# EAGLE design PGTN021_octasource_led_drivers (EAGLE 9.6.0)
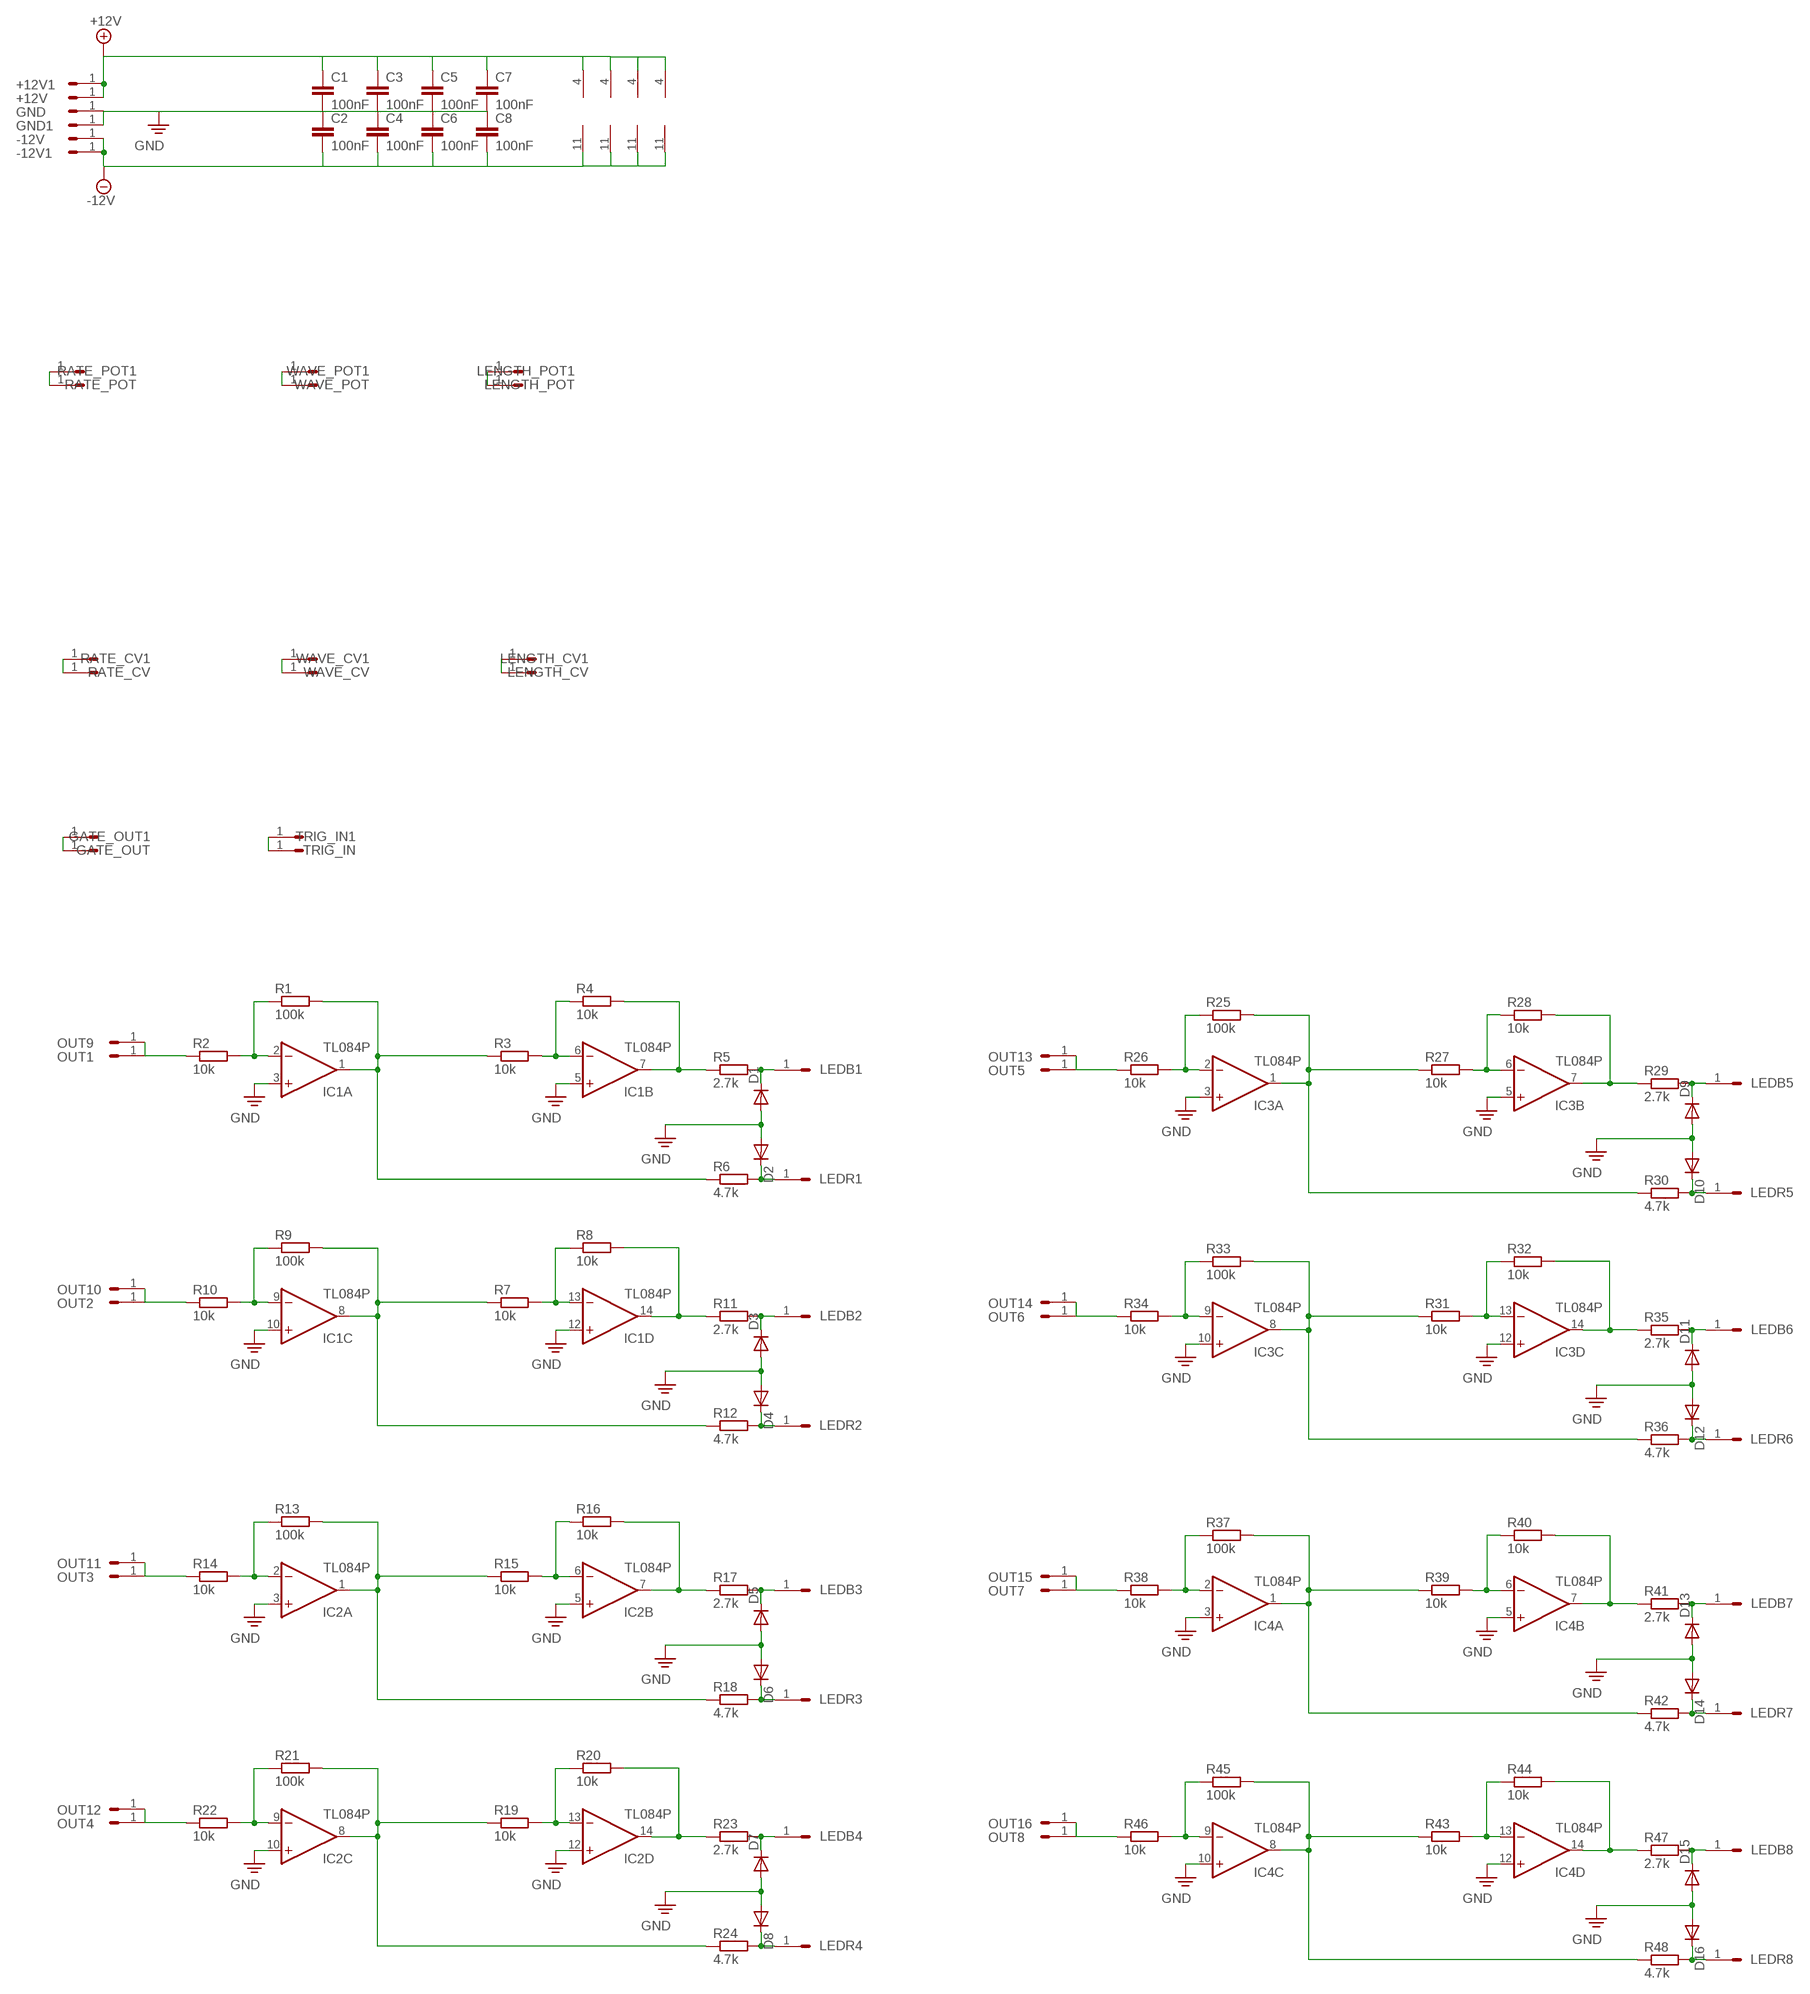
[diagram p0: schematic, sheet 1]

## Parts
+12V  HEADER/MALE/01  [HEADER/MALE/01]
+12V1  HEADER/MALE/01  [HEADER/MALE/01]
-12V  HEADER/MALE/01  [HEADER/MALE/01]
-12V1  HEADER/MALE/01  [HEADER/MALE/01]
C1  100nF  CAPACITORCERAMICDISC/5  [CERAMICDISC/5]
C2  100nF  CAPACITORCERAMICDISC/5  [CERAMICDISC/5]
C3  100nF  CAPACITORCERAMICDISC/5  [CERAMICDISC/5]
C4  100nF  CAPACITORCERAMICDISC/5  [CERAMICDISC/5]
C5  100nF  CAPACITORCERAMICDISC/5  [CERAMICDISC/5]
C6  100nF  CAPACITORCERAMICDISC/5  [CERAMICDISC/5]
C7  100nF  CAPACITORCERAMICDISC/5  [CERAMICDISC/5]
C8  100nF  CAPACITORCERAMICDISC/5  [CERAMICDISC/5]
D1  1N4148DO35-7  [DO35-7]
D2  1N4148DO35-7  [DO35-7]
D3  1N4148DO35-7  [DO35-7]
D4  1N4148DO35-7  [DO35-7]
D5  1N4148DO35-7  [DO35-7]
D6  1N4148DO35-7  [DO35-7]
D7  1N4148DO35-7  [DO35-7]
D8  1N4148DO35-7  [DO35-7]
D9  1N4148DO35-7  [DO35-7]
D10  1N4148DO35-7  [DO35-7]
D11  1N4148DO35-7  [DO35-7]
D12  1N4148DO35-7  [DO35-7]
D13  1N4148DO35-7  [DO35-7]
D14  1N4148DO35-7  [DO35-7]
D15  1N4148DO35-7  [DO35-7]
D16  1N4148DO35-7  [DO35-7]
GATE_OUT  HEADER/MALE/01  [HEADER/MALE/01]
GATE_OUT1  HEADER/MALE/01  [HEADER/MALE/01]
GND  HEADER/MALE/01  [HEADER/MALE/01]
GND1  HEADER/MALE/01  [HEADER/MALE/01]
IC1  TL084P  [DIL14]
IC2  TL084P  [DIL14]
IC3  TL084P  [DIL14]
IC4  TL084P  [DIL14]
LEDB1  HEADER/MALE/01  [HEADER/MALE/01]
LEDB2  HEADER/MALE/01  [HEADER/MALE/01]
LEDB3  HEADER/MALE/01  [HEADER/MALE/01]
LEDB4  HEADER/MALE/01  [HEADER/MALE/01]
LEDB5  HEADER/MALE/01  [HEADER/MALE/01]
LEDB6  HEADER/MALE/01  [HEADER/MALE/01]
LEDB7  HEADER/MALE/01  [HEADER/MALE/01]
LEDB8  HEADER/MALE/01  [HEADER/MALE/01]
LEDR1  HEADER/MALE/01  [HEADER/MALE/01]
LEDR2  HEADER/MALE/01  [HEADER/MALE/01]
LEDR3  HEADER/MALE/01  [HEADER/MALE/01]
LEDR4  HEADER/MALE/01  [HEADER/MALE/01]
LEDR5  HEADER/MALE/01  [HEADER/MALE/01]
LEDR6  HEADER/MALE/01  [HEADER/MALE/01]
LEDR7  HEADER/MALE/01  [HEADER/MALE/01]
LEDR8  HEADER/MALE/01  [HEADER/MALE/01]
LENGTH_CV  HEADER/MALE/01  [HEADER/MALE/01]
LENGTH_CV1  HEADER/MALE/01  [HEADER/MALE/01]
LENGTH_POT  HEADER/MALE/01  [HEADER/MALE/01]
LENGTH_POT1  HEADER/MALE/01  [HEADER/MALE/01]
OUT1  HEADER/MALE/01  [HEADER/MALE/01]
OUT2  HEADER/MALE/01  [HEADER/MALE/01]
OUT3  HEADER/MALE/01  [HEADER/MALE/01]
OUT4  HEADER/MALE/01  [HEADER/MALE/01]
OUT5  HEADER/MALE/01  [HEADER/MALE/01]
OUT6  HEADER/MALE/01  [HEADER/MALE/01]
OUT7  HEADER/MALE/01  [HEADER/MALE/01]
OUT8  HEADER/MALE/01  [HEADER/MALE/01]
OUT9  HEADER/MALE/01  [HEADER/MALE/01]
OUT10  HEADER/MALE/01  [HEADER/MALE/01]
OUT11  HEADER/MALE/01  [HEADER/MALE/01]
OUT12  HEADER/MALE/01  [HEADER/MALE/01]
OUT13  HEADER/MALE/01  [HEADER/MALE/01]
OUT14  HEADER/MALE/01  [HEADER/MALE/01]
OUT15  HEADER/MALE/01  [HEADER/MALE/01]
OUT16  HEADER/MALE/01  [HEADER/MALE/01]
R1  100k  RESISTORRESISTOR/UPRIGHT/7.5  [RESISTOR/7.5]
R2  10k  RESISTORRESISTOR/UPRIGHT/7.5  [RESISTOR/7.5]
R3  10k  RESISTORRESISTOR/UPRIGHT/7.5  [RESISTOR/7.5]
R4  10k  RESISTORRESISTOR/UPRIGHT/7.5  [RESISTOR/7.5]
R5  2.7k  RESISTORRESISTOR/UPRIGHT/7.5  [RESISTOR/7.5]
R6  4.7k  RESISTORRESISTOR/UPRIGHT/7.5  [RESISTOR/7.5]
R7  10k  RESISTORRESISTOR/UPRIGHT/7.5  [RESISTOR/7.5]
R8  10k  RESISTORRESISTOR/UPRIGHT/7.5  [RESISTOR/7.5]
R9  100k  RESISTORRESISTOR/UPRIGHT/7.5  [RESISTOR/7.5]
R10  10k  RESISTORRESISTOR/UPRIGHT/7.5  [RESISTOR/7.5]
R11  2.7k  RESISTORRESISTOR/UPRIGHT/7.5  [RESISTOR/7.5]
R12  4.7k  RESISTORRESISTOR/UPRIGHT/7.5  [RESISTOR/7.5]
R13  100k  RESISTORRESISTOR/UPRIGHT/7.5  [RESISTOR/7.5]
R14  10k  RESISTORRESISTOR/UPRIGHT/7.5  [RESISTOR/7.5]
R15  10k  RESISTORRESISTOR/UPRIGHT/7.5  [RESISTOR/7.5]
R16  10k  RESISTORRESISTOR/UPRIGHT/7.5  [RESISTOR/7.5]
R17  2.7k  RESISTORRESISTOR/UPRIGHT/7.5  [RESISTOR/7.5]
R18  4.7k  RESISTORRESISTOR/UPRIGHT/7.5  [RESISTOR/7.5]
R19  10k  RESISTORRESISTOR/UPRIGHT/7.5  [RESISTOR/7.5]
R20  10k  RESISTORRESISTOR/UPRIGHT/7.5  [RESISTOR/7.5]
R21  100k  RESISTORRESISTOR/UPRIGHT/7.5  [RESISTOR/7.5]
R22  10k  RESISTORRESISTOR/UPRIGHT/7.5  [RESISTOR/7.5]
R23  2.7k  RESISTORRESISTOR/UPRIGHT/7.5  [RESISTOR/7.5]
R24  4.7k  RESISTORRESISTOR/UPRIGHT/7.5  [RESISTOR/7.5]
R25  100k  RESISTORRESISTOR/UPRIGHT/7.5  [RESISTOR/7.5]
R26  10k  RESISTORRESISTOR/UPRIGHT/7.5  [RESISTOR/7.5]
R27  10k  RESISTORRESISTOR/UPRIGHT/7.5  [RESISTOR/7.5]
R28  10k  RESISTORRESISTOR/UPRIGHT/7.5  [RESISTOR/7.5]
R29  2.7k  RESISTORRESISTOR/UPRIGHT/7.5  [RESISTOR/7.5]
R30  4.7k  RESISTORRESISTOR/UPRIGHT/7.5  [RESISTOR/7.5]
R31  10k  RESISTORRESISTOR/UPRIGHT/7.5  [RESISTOR/7.5]
R32  10k  RESISTORRESISTOR/UPRIGHT/7.5  [RESISTOR/7.5]
R33  100k  RESISTORRESISTOR/UPRIGHT/7.5  [RESISTOR/7.5]
R34  10k  RESISTORRESISTOR/UPRIGHT/7.5  [RESISTOR/7.5]
R35  2.7k  RESISTORRESISTOR/UPRIGHT/7.5  [RESISTOR/7.5]
R36  4.7k  RESISTORRESISTOR/UPRIGHT/7.5  [RESISTOR/7.5]
R37  100k  RESISTORRESISTOR/UPRIGHT/7.5  [RESISTOR/7.5]
R38  10k  RESISTORRESISTOR/UPRIGHT/7.5  [RESISTOR/7.5]
R39  10k  RESISTORRESISTOR/UPRIGHT/7.5  [RESISTOR/7.5]
R40  10k  RESISTORRESISTOR/UPRIGHT/7.5  [RESISTOR/7.5]
R41  2.7k  RESISTORRESISTOR/UPRIGHT/7.5  [RESISTOR/7.5]
R42  4.7k  RESISTORRESISTOR/UPRIGHT/7.5  [RESISTOR/7.5]
R43  10k  RESISTORRESISTOR/UPRIGHT/7.5  [RESISTOR/7.5]
R44  10k  RESISTORRESISTOR/UPRIGHT/7.5  [RESISTOR/7.5]
R45  100k  RESISTORRESISTOR/UPRIGHT/7.5  [RESISTOR/7.5]
R46  10k  RESISTORRESISTOR/UPRIGHT/7.5  [RESISTOR/7.5]
R47  2.7k  RESISTORRESISTOR/UPRIGHT/7.5  [RESISTOR/7.5]
R48  4.7k  RESISTORRESISTOR/UPRIGHT/7.5  [RESISTOR/7.5]
RATE_CV  HEADER/MALE/01  [HEADER/MALE/01]
RATE_CV1  HEADER/MALE/01  [HEADER/MALE/01]
RATE_POT  HEADER/MALE/01  [HEADER/MALE/01]
RATE_POT1  HEADER/MALE/01  [HEADER/MALE/01]
TRIG_IN  HEADER/MALE/01  [HEADER/MALE/01]
TRIG_IN1  HEADER/MALE/01  [HEADER/MALE/01]
WAVE_CV  HEADER/MALE/01  [HEADER/MALE/01]
WAVE_CV1  HEADER/MALE/01  [HEADER/MALE/01]
WAVE_POT  HEADER/MALE/01  [HEADER/MALE/01]
WAVE_POT1  HEADER/MALE/01  [HEADER/MALE/01]

## Nets
+12V: +12V1.1 +12V.1 C1.1 C3.1 C5.1 C7.1 IC1.4(P:V+) IC2.4(P:V+) IC3.4(P:V+) IC4.4(P:V+)
-12V: -12V1.1 -12V.1 C2.2 C4.2 C6.2 C8.2 IC1.11(P:V-) IC2.11(P:V-) IC3.11(P:V-) IC4.11(P:V-)
N$1: IC1.6(B:-IN) R3.2 R4.1
N$2: IC1.2(A:-IN) R1.1 R2.2
N$3: IC1.1(A:OUT) R1.2 R3.1 R6.1
N$4: OUT1.1 OUT9.1 R2.1
N$5: IC1.7(B:OUT) R4.2 R5.1
N$6: D1.C LEDB1.1 R5.2
N$7: D2.C LEDR1.1 R6.2
N$8: IC1.13(D:-IN) R7.2 R8.1
N$9: IC1.9(C:-IN) R9.1 R10.2
N$10: OUT2.1 OUT10.1 R10.1
N$11: IC1.14(D:OUT) R8.2 R11.1
N$12: IC1.8(C:OUT) R7.1 R9.2 R12.1
N$13: IC2.2(A:-IN) R13.1 R14.2
N$14: D3.C LEDB2.1 R11.2
N$15: D4.C LEDR2.1 R12.2
N$16: IC2.1(A:OUT) R13.2 R15.1 R18.1
N$17: IC2.6(B:-IN) R15.2 R16.1
N$18: OUT3.1 OUT11.1 R14.1
N$19: IC2.7(B:OUT) R16.2 R17.1
N$20: D5.C LEDB3.1 R17.2
N$21: D6.C LEDR3.1 R18.2
N$22: IC2.13(D:-IN) R19.2 R20.1
N$23: IC2.9(C:-IN) R21.1 R22.2
N$24: IC2.14(D:OUT) R20.2 R23.1
N$25: IC2.8(C:OUT) R19.1 R21.2 R24.1
N$26: D7.C LEDB4.1 R23.2
N$27: D8.C LEDR4.1 R24.2
N$28: OUT4.1 OUT12.1 R22.1
N$29: IC3.2(A:-IN) R25.1 R26.2
N$30: IC3.1(A:OUT) R25.2 R27.1 R30.1
N$31: IC3.6(B:-IN) R27.2 R28.1
N$32: OUT5.1 OUT13.1 R26.1
N$33: IC3.7(B:OUT) R28.2 R29.1
N$34: D9.C LEDB5.1 R29.2
N$35: D10.C LEDR5.1 R30.2
N$36: IC3.13(D:-IN) R31.2 R32.1
N$37: IC3.9(C:-IN) R33.1 R34.2
N$38: IC3.14(D:OUT) R32.2 R35.1
N$39: IC3.8(C:OUT) R31.1 R33.2 R36.1
N$40: D11.C LEDB6.1 R35.2
N$41: D12.C LEDR6.1 R36.2
N$42: OUT6.1 OUT14.1 R34.1
N$43: RATE_POT1.1 RATE_POT.1
N$44: IC4.2(A:-IN) R37.1 R38.2
N$45: IC4.1(A:OUT) R37.2 R39.1 R42.1
N$46: IC4.6(B:-IN) R39.2 R40.1
N$47: OUT7.1 OUT15.1 R38.1
N$48: IC4.7(B:OUT) R40.2 R41.1
N$49: D13.C LEDB7.1 R41.2
N$50: D14.C LEDR7.1 R42.2
N$51: IC4.13(D:-IN) R43.2 R44.1
N$52: IC4.9(C:-IN) R45.1 R46.2
N$53: IC4.14(D:OUT) R44.2 R47.1
N$54: IC4.8(C:OUT) R43.1 R45.2 R48.1
N$55: D15.C LEDB8.1 R47.2
N$56: D16.C LEDR8.1 R48.2
N$57: OUT8.1 OUT16.1 R46.1
N$58: RATE_CV1.1 RATE_CV.1
N$59: GATE_OUT1.1 GATE_OUT.1
N$60: TRIG_IN1.1 TRIG_IN.1
N$61: WAVE_CV1.1 WAVE_CV.1
N$62: LENGTH_CV1.1 LENGTH_CV.1
N$63: LENGTH_POT1.1 LENGTH_POT.1
N$64: WAVE_POT1.1 WAVE_POT.1
PE: C1.2 C2.1 C3.2 C4.1 C5.2 C6.1 C7.2 C8.1 D1.A D2.A D3.A D4.A D5.A D6.A D7.A D8.A D9.A D10.A D11.A D12.A D13.A D14.A D15.A D16.A GND1.1 GND.1 IC1.3(A:+IN) IC1.5(B:+IN) IC1.10(C:+IN) IC1.12(D:+IN) IC2.3(A:+IN) IC2.5(B:+IN) IC2.10(C:+IN) IC2.12(D:+IN) IC3.3(A:+IN) IC3.5(B:+IN) IC3.10(C:+IN) IC3.12(D:+IN) IC4.3(A:+IN) IC4.5(B:+IN) IC4.10(C:+IN) IC4.12(D:+IN) ; supply symbol labelled GND

## Library data of the parts
+12V +12V1 -12V -12V1 GATE_OUT GATE_OUT1 GND GND1 LEDB1-LEDB8 LEDR1-LEDR8 LENGTH_CV LENGTH_CV1 LENGTH_POT LENGTH_POT1 OUT1-OUT16 RATE_CV RATE_CV1 RATE_POT RATE_POT1 TRIG_IN TRIG_IN1 WAVE_CV WAVE_CV1 WAVE_POT WAVE_POT1 = connectors:HEADER/MALE/01
C1-C8 = capacitors:CAPACITOR: CAPACITOR, European symbol
D1-D16 = transistors:1N4148: DIODE high speed (Philips)
IC1-IC4 = ic_analogue:TL084: OP AMP
R1-R48 = resistors:RESISTOR: RESISTOR, European symbol

## Board
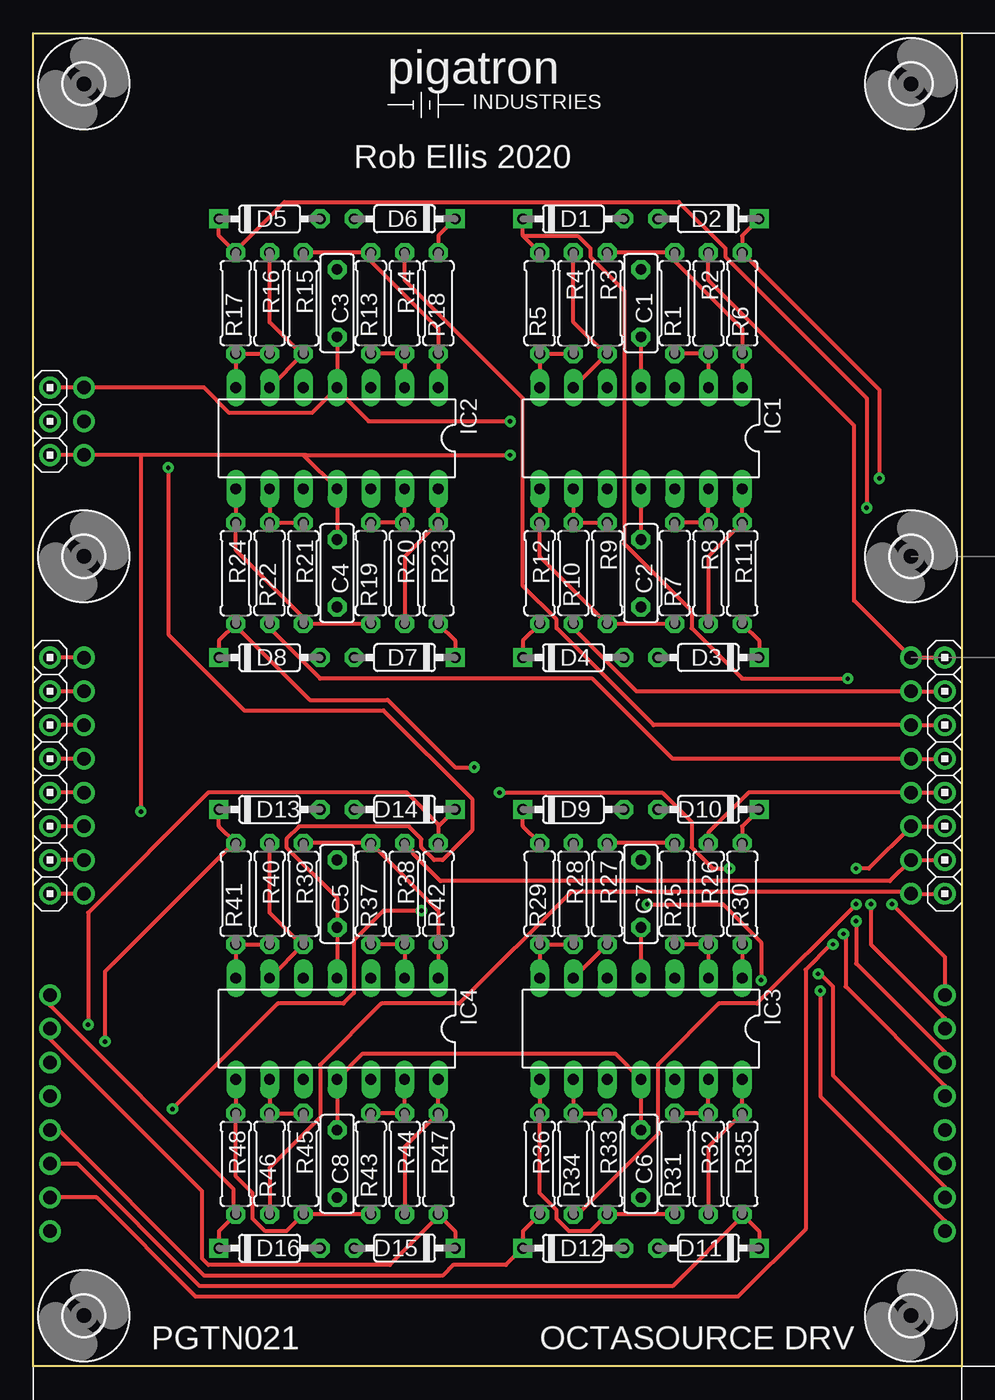
[diagram p1: board, top side]
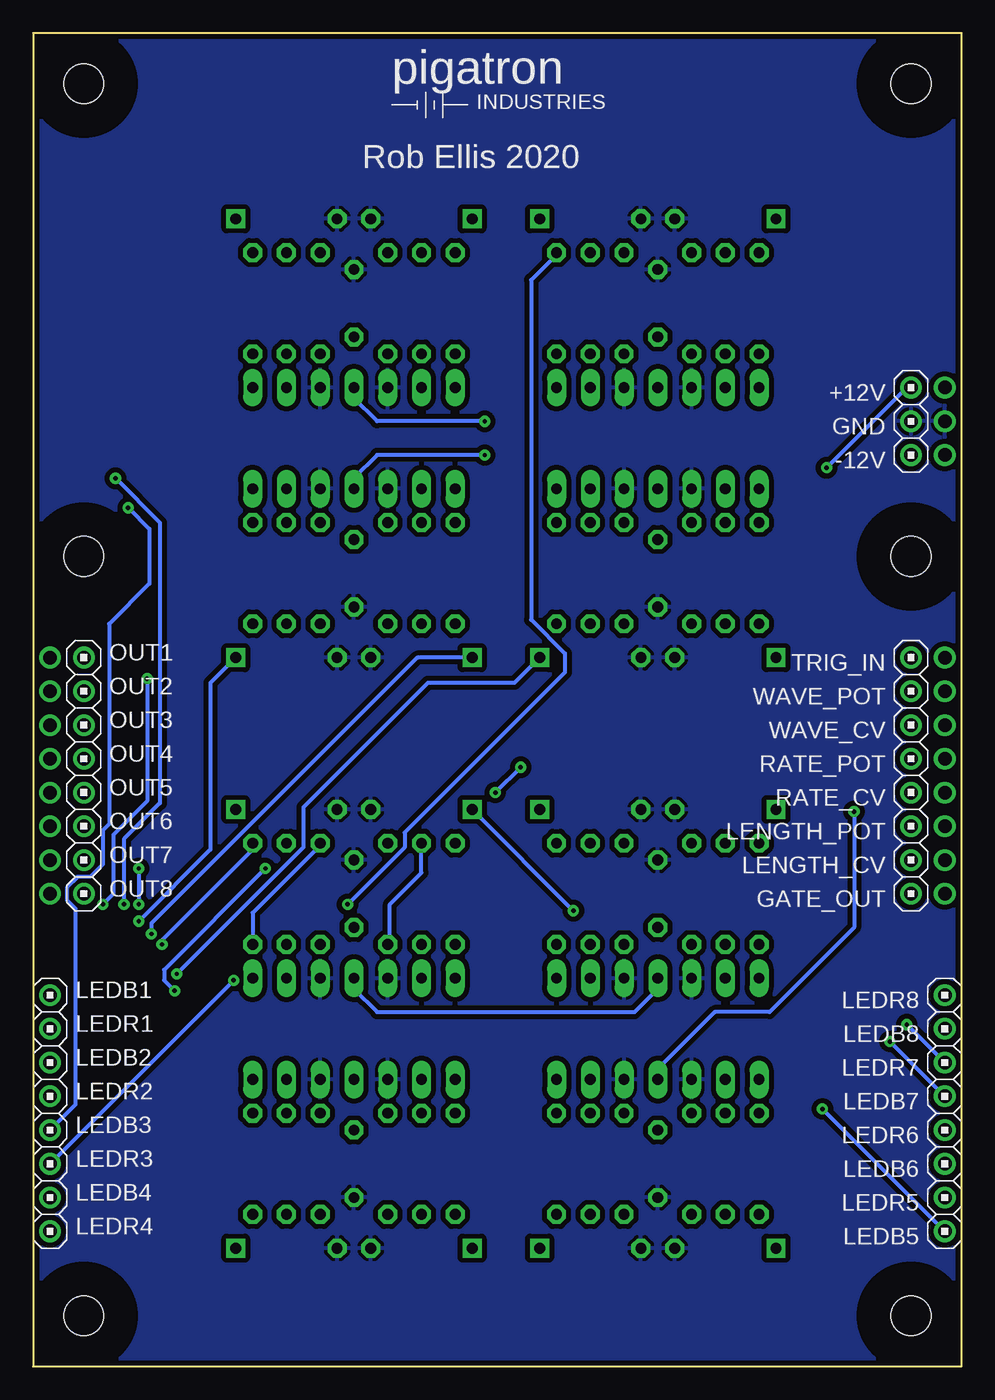
[diagram p2: board, bottom side, seen from below]

Size 69.85 x 100.33 mm. Coordinates in mm from the lower left corner, seen from the top.
Outline: 0,0 0,100.33 69.85,100.33 69.85,0 0,0
Copper layers (1*16): Top 0.0356mm / dielectric 1.5011mm / Bottom 0.0356mm
Design rules "pigatron": minimum track width 12mil, minimum drill 13mil, track to track 15mil, track to pad 10mil, pad to pad 10mil, via to via 10mil, smd to smd 6mil, copper to edge 15mil, drill to drill 10mil, minimum pad ring 12mil, minimum via ring 10mil, stop-mask expansion 4mil, vias tented up to drill 0mil, thermal gap 10mil

### Footprints (pad centres in the part's own frame; a part is rotated, then mirrored left to right if it is on the bottom)
HEADER/MALE/01 = drill 1.016: 1 0,0
CERAMICDISC/5 = drill 0.813 octagon: 1 -2.54,0; 2 2.54,0
DO35-7 = drill 0.813 octagon: A 3.81,0 | drill 0.813 square: C -3.81,0
DIL14 = drill 0.813 long: 1 -7.62,-3.81; 2 -5.08,-3.81; 3 -2.54,-3.81; 4 0,-3.81; 5 2.54,-3.81; 6 5.08,-3.81; 7 7.62,-3.81; 8 7.62,3.81; 9 5.08,3.81; 10 2.54,3.81; 11 0,3.81; 12 -2.54,3.81; 13 -5.08,3.81; 14 -7.62,3.81
RESISTOR/7.5 = drill 0.813 octagon: 1 -3.81,0; 2 3.81,0
STANDOFF/3.0 = hole 3: 0,0

### Placement (x,y rotation side)
+12V  3.81,73.66 180 bottom
+12V1  1.27,73.66 0 top
-12V  3.81,68.58 180 bottom
-12V1  1.27,68.58 0 top
C1  45.72,80.01 90 top
C2  45.72,59.69 90 top
C3  22.86,80.01 90 top
C4  22.86,59.69 90 top
C5  22.86,35.56 90 top
C6  45.72,15.24 90 top
C7  45.72,35.56 90 top
C8  22.86,15.24 90 top
D1  40.64,86.36 0 top
D2  50.8,86.36 180 top
D3  50.8,53.34 180 top
D4  40.64,53.34 0 top
D5  17.78,86.36 0 top
D6  27.94,86.36 180 top
D7  27.94,53.34 180 top
D8  17.78,53.34 0 top
D9  40.64,41.91 0 top
D10  50.8,41.91 180 top
D11  50.8,8.89 180 top
D12  40.64,8.89 0 top
D13  17.78,41.91 0 top
D14  27.94,41.91 180 top
D15  27.94,8.89 180 top
D16  17.78,8.89 0 top
GATE_OUT  3.81,35.56 180 bottom
GATE_OUT1  1.27,35.56 0 top
GND  3.81,71.12 180 bottom
GND1  1.27,71.12 0 top
IC1  45.72,69.85 180 top
IC2  22.86,69.85 180 top
IC3  45.72,25.4 180 top
IC4  22.86,25.4 180 top
LEDB1  68.58,27.94 0 bottom
LEDB2  68.58,22.86 0 bottom
LEDB3  68.58,17.78 0 bottom
LEDB4  68.58,12.7 0 bottom
LEDB5  1.27,10.16 180 bottom
LEDB6  1.27,15.24 180 bottom
LEDB7  1.27,20.32 180 bottom
LEDB8  1.27,25.4 180 bottom
LEDR1  68.58,25.4 0 bottom
LEDR2  68.58,20.32 0 bottom
LEDR3  68.58,15.24 0 bottom
LEDR4  68.58,10.16 0 bottom
LEDR5  1.27,12.7 180 bottom
LEDR6  1.27,17.78 180 bottom
LEDR7  1.27,22.86 180 bottom
LEDR8  1.27,27.94 180 bottom
LENGTH_CV  3.81,38.1 180 bottom
LENGTH_CV1  1.27,38.1 0 top
LENGTH_POT  3.81,40.64 180 bottom
LENGTH_POT1  1.27,40.64 0 top
OUT1  66.04,53.34 0 bottom
OUT2  66.04,50.8 0 bottom
OUT3  66.04,48.26 0 bottom
OUT4  66.04,45.72 0 bottom
OUT5  66.04,43.18 0 bottom
OUT6  66.04,40.64 0 bottom
OUT7  66.04,38.1 0 bottom
OUT8  66.04,35.56 0 bottom
OUT9  68.58,53.34 0 top
OUT10  68.58,50.8 0 top
OUT11  68.58,48.26 0 top
OUT12  68.58,45.72 0 top
OUT13  68.58,43.18 0 top
OUT14  68.58,40.64 0 top
OUT15  68.58,38.1 0 top
OUT16  68.58,35.56 0 top
R1  48.26,80.01 90 top
R2  50.8,80.01 270 top
R3  43.18,80.01 270 top
R4  40.64,80.01 270 top
R5  38.1,80.01 90 top
R6  53.34,80.01 90 top
R7  48.26,59.69 90 top
R8  50.8,59.69 270 top
R9  43.18,59.69 270 top
R10  40.64,59.69 90 top
R11  53.34,59.69 270 top
R12  38.1,59.69 270 top
R13  25.4,80.01 90 top
R14  27.94,80.01 270 top
R15  20.32,80.01 270 top
R16  17.78,80.01 270 top
R17  15.24,80.01 90 top
R18  30.48,80.01 90 top
R19  25.4,59.69 90 top
R20  27.94,59.69 270 top
R21  20.32,59.69 270 top
R22  17.78,59.69 90 top
R23  30.48,59.69 270 top
R24  15.24,59.69 270 top
R25  48.26,35.56 90 top
R26  50.8,35.56 270 top
R27  43.18,35.56 270 top
R28  40.64,35.56 270 top
R29  38.1,35.56 90 top
R30  53.34,35.56 90 top
R31  48.26,15.24 90 top
R32  50.8,15.24 270 top
R33  43.18,15.24 270 top
R34  40.64,15.24 90 top
R35  53.34,15.24 270 top
R36  38.1,15.24 270 top
R37  25.4,35.56 90 top
R38  27.94,35.56 270 top
R39  20.32,35.56 270 top
R40  17.78,35.56 270 top
R41  15.24,35.56 90 top
R42  30.48,35.56 90 top
R43  25.4,15.24 90 top
R44  27.94,15.24 270 top
R45  20.32,15.24 270 top
R46  17.78,15.24 90 top
R47  30.48,15.24 270 top
R48  15.24,15.24 270 top
RATE_CV  3.81,43.18 180 bottom
RATE_CV1  1.27,43.18 0 top
RATE_POT  3.81,45.72 180 bottom
RATE_POT1  1.27,45.72 0 top
TRIG_IN  3.81,53.34 180 bottom
TRIG_IN1  1.27,53.34 0 top
U$1  [PIGATRON-LOGO]  35.56,96.52 0 top
U$2  [PIGATRON-LOGO]  33.97,96.52 0 bottom
U$4  [STANDOFF/3.0]  66.04,60.96 0 top
U$5  [STANDOFF/3.0]  3.81,60.96 0 top
U$9  [STANDOFF/3.0]  3.81,3.81 0 top
U$10  [STANDOFF/3.0]  66.04,3.81 0 top
U$11  [STANDOFF/3.0]  3.81,96.52 0 top
U$12  [STANDOFF/3.0]  66.04,96.52 0 top
WAVE_CV  3.81,48.26 180 bottom
WAVE_CV1  1.27,48.26 0 top
WAVE_POT  3.81,50.8 180 bottom
WAVE_POT1  1.27,50.8 0 top

### Tracks (layer width: path | path; a pad name or v marks a point on that pad's centre or on a via)
+12V  (via drill 0.33)
  Top 0.305: IC4.4 C5.1 22.86,35.24 19.05,39.05 19.05,39.69 20,40.64 28.26,40.64 29.21,39.69 29.21,39.05 30.16,38.1 30.8,38.1 33.02,40.32 33.02,42.7 26.35,49.37 15.88,49.37 10.16,55.09 v10.16,67.63 | C7.1 IC3.4 | C1.1 IC1.4 | +12V1.1 +12V.1 12.86,73.66 14.76,71.75 20.95,71.75 IC2.4 | C3.1 IC2.4 | v35.88,71.12 25.24,71.12 22.86,73.5 IC2.4
  Bottom 0.305: IC4.4 22.86,28.42 24.61,26.67 43.97,26.67 45.72,28.42 IC3.4 | IC1.4 45.72,72.87 43.97,71.12 v35.88,71.12 | v10.16,67.63 4.13,73.66 +12V.1
-12V  (via drill 0.33)
  Top 0.305: C8.2 IC4.11 24.77,23.5 43.81,23.5 IC3.11 C6.2 | IC1.11 C2.2 | -12V1.1 -12V.1 8.1,68.58 | C4.2 IC2.11 20.4,68.5 | 8.1,68.58 20.32,68.58 20.4,68.5 | v35.88,68.58 20.48,68.58 20.4,68.5 | 8.1,68.58 v8.1,41.75
  Bottom 0.305: IC1.11 45.72,66.83 43.97,68.58 v35.88,68.58 | IC4.11 22.86,22.38 18.57,26.67 14.45,26.67 8.1,33.02 v8.1,41.75
N$1
  Top 0.305: IC1.6 R3.2 43.02,76.2 40.64,78.58 R4.1
N$2
  Top 0.305: IC1.2 R2.2 R1.1
N$3
  Top 0.305: IC1.1 R6.1 53.34,78.11 47.62,83.82 | 47.62,83.82 R3.1 | 47.62,83.82 R1.2
N$4
  Top 0.305: R2.1 50.8,81.76 61.75,70.8 61.75,57.63 OUT1.1 OUT9.1
N$5
  Top 0.305: IC1.7 R5.1 R4.2
N$6  (via drill 0.33)
  Top 0.305: D1.C 36.83,85.09 36.91,85.01 | R5.2 36.91,85.01 | LEDB1.1 68.58,30.8 v64.61,34.77 | v61.28,51.75 53.34,51.75 49.53,55.56 49.53,56.83 44.45,61.91 44.45,80.96 41.91,83.5 41.91,84.14 40.96,85.09 36.99,85.09 36.91,85.01
  Bottom 0.305: v64.61,34.77 63.82,35.56 63.82,40.01 61.28,42.55 v61.28,51.75
N$7  (via drill 0.33)
  Top 0.305: D2.C 53.34,85.09 R6.2 63.66,73.5 v63.66,66.83 | LEDR1.1 68.58,26.19 63.02,31.75 v63.02,34.77
  Bottom 0.305: v63.02,34.77 63.02,39.69 60.33,42.39 60.33,63.5 v63.66,66.83
N$8
  Top 0.305: R7.2 R8.1 IC1.13
N$9
  Top 0.305: IC1.9 R10.2 R9.1
N$10
  Top 0.305: R10.1 40.64,55.56 45.4,50.8 OUT2.1 OUT10.1
N$11
  Top 0.305: R8.2 50.8,60.96 R11.1 IC1.14
N$12
  Top 0.305: IC1.8 R12.1 38.1,60.96 R9.2 R7.1
N$13
  Top 0.305: IC2.2 R14.2 R13.1
N$14  (via drill 0.33)
  Top 0.305: D3.C 54.61,54.61 R11.2 | LEDB2.1 68.58,23.65 61.91,30.32 v61.91,33.5
  Bottom 0.305: v61.91,33.5 56.52,38.89 56.52,51.44 D3.C
N$15  (via drill 0.33)
  Top 0.305: D4.C 36.83,54.61 R12.2 | LEDR2.1 68.58,21.11 61.12,28.57 61.12,32.38 v60.96,32.54
  Bottom 0.305: v60.96,32.54 60.96,33.34 40.96,53.34 D4.C
N$16
  Top 0.305: IC2.1 R18.1 30.48,78.11 24.77,83.82 | 24.77,83.82 R15.1 | 24.77,83.82 R13.2
N$17
  Top 0.305: IC2.6 R15.2 20.16,76.2 17.78,78.58 R16.1
N$18
  Top 0.305: R14.1 27.94,81.76 36.83,72.87 36.83,58.74 39.37,56.2 39.37,55.56 46.67,48.26 OUT3.1 OUT11.1
N$19
  Top 0.305: IC2.7 R17.1 R16.2
N$20  (via drill 0.33)
  Top 0.305: D5.C 13.97,85.09 R17.2 15.24,83.98 18.89,87.63 48.58,87.63 52.07,84.14 52.07,83.5 62.71,72.87 v62.71,64.61
  Bottom 0.305: LEDB3.1 66.67,19.68 66.67,34.45 67.31,35.08 67.31,36.04 66.52,36.83 65.56,36.83 64.61,37.78 64.61,40.32 64.14,40.8 64.14,55.88 61.12,58.9 61.12,63.02 v62.71,64.61
N$21  (via drill 0.33)
  Top 0.305: R18.2 30.48,85.09 D6.C | v54.77,29.05 54.77,31.91 51.91,34.77 v46.2,34.77
  Bottom 0.305: v54.77,29.05 LEDR3.1 | v46.2,34.77 41.91,39.05 41.91,40.16 29.84,52.23 29.84,53.66 32.38,56.2 32.38,81.76 30.48,83.66 R18.2
N$22
  Top 0.305: R19.2 R20.1 IC2.13
N$23
  Top 0.305: IC2.9 R22.2 R21.1
N$24
  Top 0.305: R20.2 27.94,60.96 R23.1 IC2.14
N$25
  Top 0.305: IC2.8 R24.1 15.24,61.44 20.8,55.88 | R19.1 20.8,55.88 | 20.8,55.88 R21.2
N$26  (via drill 0.33)
  Top 0.305: D7.C 31.75,54.61 R23.2 | LEDB4.1 68.58,13.49 60.17,21.91 60.17,28.57 59.21,29.53 v59.05,29.53
  Bottom 0.305: v59.05,29.53 49.53,39.05 49.53,42.07 40.16,51.44 33.66,51.44 D7.C
N$27  (via drill 0.33)
  Top 0.305: D8.C 13.97,54.61 R24.2 15.24,55.72 20.8,50.16 26.67,50.16 31.75,45.09 v33.18,45.09 | LEDR4.1 68.58,10.95 59.21,20.32 v59.21,28.26 | v52.39,37.47 51.12,37.47 49.53,39.05 49.53,40.96 47.31,43.18 v35.08,43.18
  Bottom 0.305: v59.21,28.26 60.01,29.05 60.01,29.84 v52.39,37.47 | v33.18,45.09 v35.08,43.18
N$28
  Top 0.305: R22.1 17.78,55.56 21.59,51.75 42.07,51.75 48.1,45.72 OUT4.1 OUT12.1
N$29
  Top 0.305: IC3.2 R26.2 R25.1
N$30
  Top 0.305: R30.1 IC3.1 | R25.2 R27.1
  Bottom 0.305: R30.1 53.34,34.13 48.26,39.21 R25.2
N$31
  Top 0.305: R27.2 IC3.6
  Bottom 0.305: R28.1 40.64,37.15 43.02,34.77 43.02,31.91 R27.2
N$32
  Top 0.305: R26.1 50.8,40.16 53.82,43.18 OUT5.1 OUT13.1
N$33
  Top 0.305: IC3.7 R29.1 R28.2
N$34  (via drill 0.33)
  Top 0.305: D9.C 36.83,40.64 R29.2 | v10.48,19.37 18.41,27.3 23.34,27.3 24.13,28.1 24.13,32.07 26.35,34.29 v29.21,34.29
  Bottom 0.305: v10.48,19.37 LEDB5.1 | D9.C v29.21,34.29
N$35  (via drill 0.33)
  Top 0.305: R30.2 53.34,40.64 D10.C | LEDR5.1 4.76,12.7 12.22,5.24 53.02,5.24 58.1,10.32 58.1,29.84 60.01,31.75 v60.17,31.75
  Bottom 0.305: v60.17,31.75 60.17,32.07 53.34,38.89 R30.2
N$36
  Top 0.305: R31.2 R32.1 IC3.13
N$37
  Top 0.305: IC3.9 R34.2 R33.1
N$38
  Top 0.305: R32.2 50.8,16.51 R35.1 IC3.14
N$39
  Top 0.305: IC3.8 R36.1 38.1,13.02 39.37,11.75 39.37,11.11 40.32,10.16 41.91,10.16 R33.2 R31.1
N$40
  Top 0.305: D11.C 54.61,10.16 R35.2 53.34,11.27 48.1,6.03 12.54,6.03 3.33,15.24 LEDB6.1
N$41
  Top 0.305: R36.2 36.83,10.16 D12.C 35.56,7.62 31.59,7.62 30.8,6.83 12.86,6.83 1.91,17.78 LEDR6.1
N$42  (via drill 0.33)
  Top 0.305: R34.1 40.96,11.43 46.99,17.46 46.99,22.7 51.59,27.3 54.45,27.3 v61.91,34.77 | v61.91,37.47 62.87,37.47 OUT6.1 OUT14.1
  Bottom 0.305: v61.91,37.47 v61.91,34.77
N$43
  Top 0.305: RATE_POT.1 RATE_POT1.1
N$44
  Top 0.305: IC4.2 R38.2 R37.1
N$45
  Top 0.305: IC4.1 R42.1 30.48,34.29 R37.2 R39.1
N$46
  Top 0.305: IC4.6 R39.2 20.16,31.75 17.78,34.13 R40.1
N$47
  Top 0.305: R38.1 28.57,38.73 28.57,38.58 30.64,36.51 64.45,36.51 OUT7.1 OUT15.1
N$48
  Top 0.305: IC4.7 R41.1 R40.2
N$49  (via drill 0.33)
  Top 0.305: D13.C 13.97,40.64 R41.2 15.08,39.37 5.4,29.69 v5.4,24.45
  Bottom 0.305: v5.4,24.45 LEDB7.1
N$50  (via drill 0.33)
  Top 0.305: R42.2 30.48,40.64 30.56,40.72 | D14.C 30.56,40.72 | v4.13,25.72 4.13,34.13 13.18,43.18 28.1,43.18 30.56,40.72
  Bottom 0.305: v4.13,25.72 LEDR7.1
N$51
  Top 0.305: R43.2 R44.1 IC4.13
N$52
  Top 0.305: IC4.9 R46.2 R45.1
N$53
  Top 0.305: R44.2 27.94,16.51 R47.1 IC4.14
N$54
  Top 0.305: IC4.8 R48.1 15.24,14.29 16.51,13.02 16.51,11.11 17.46,10.16 19.05,10.16 R45.2 R43.1
N$55
  Top 0.305: D15.C 31.75,10.16 R47.2 30.48,11.27 26.83,7.62 13.18,7.62 12.7,8.1 12.7,13.18 1.27,24.61 LEDB8.1
N$56
  Top 0.305: D16.C 13.97,10.16 R48.2 15.08,11.43 15.08,13.34 1.27,27.15 LEDR8.1
N$57
  Top 0.305: R46.1 17.78,14.92 21.59,18.73 21.59,22.7 26.19,27.3 32.07,27.3 40.48,35.72 65.88,35.72 OUT8.1 OUT16.1
N$58
  Top 0.305: RATE_CV.1 RATE_CV1.1
N$59
  Top 0.305: GATE_OUT.1 GATE_OUT1.1
N$60
  Top 0.305: TRIG_IN.1 TRIG_IN1.1
N$61
  Top 0.305: WAVE_CV.1 WAVE_CV1.1
N$62
  Top 0.305: LENGTH_CV.1 LENGTH_CV1.1
N$63
  Top 0.305: LENGTH_POT.1 LENGTH_POT1.1
N$64
  Top 0.305: WAVE_POT.1 WAVE_POT1.1
PE
  pour Bottom: 0,100.33 0,0 69.85,0 69.85,100.33

### Text on the board
tNames: Rob Ellis 2020 | PGTN021 | OCTASOURCE DRV
bNames: Rob Ellis 2020